# EAGLE design Digital Greippi (EAGLE 7.4.0)
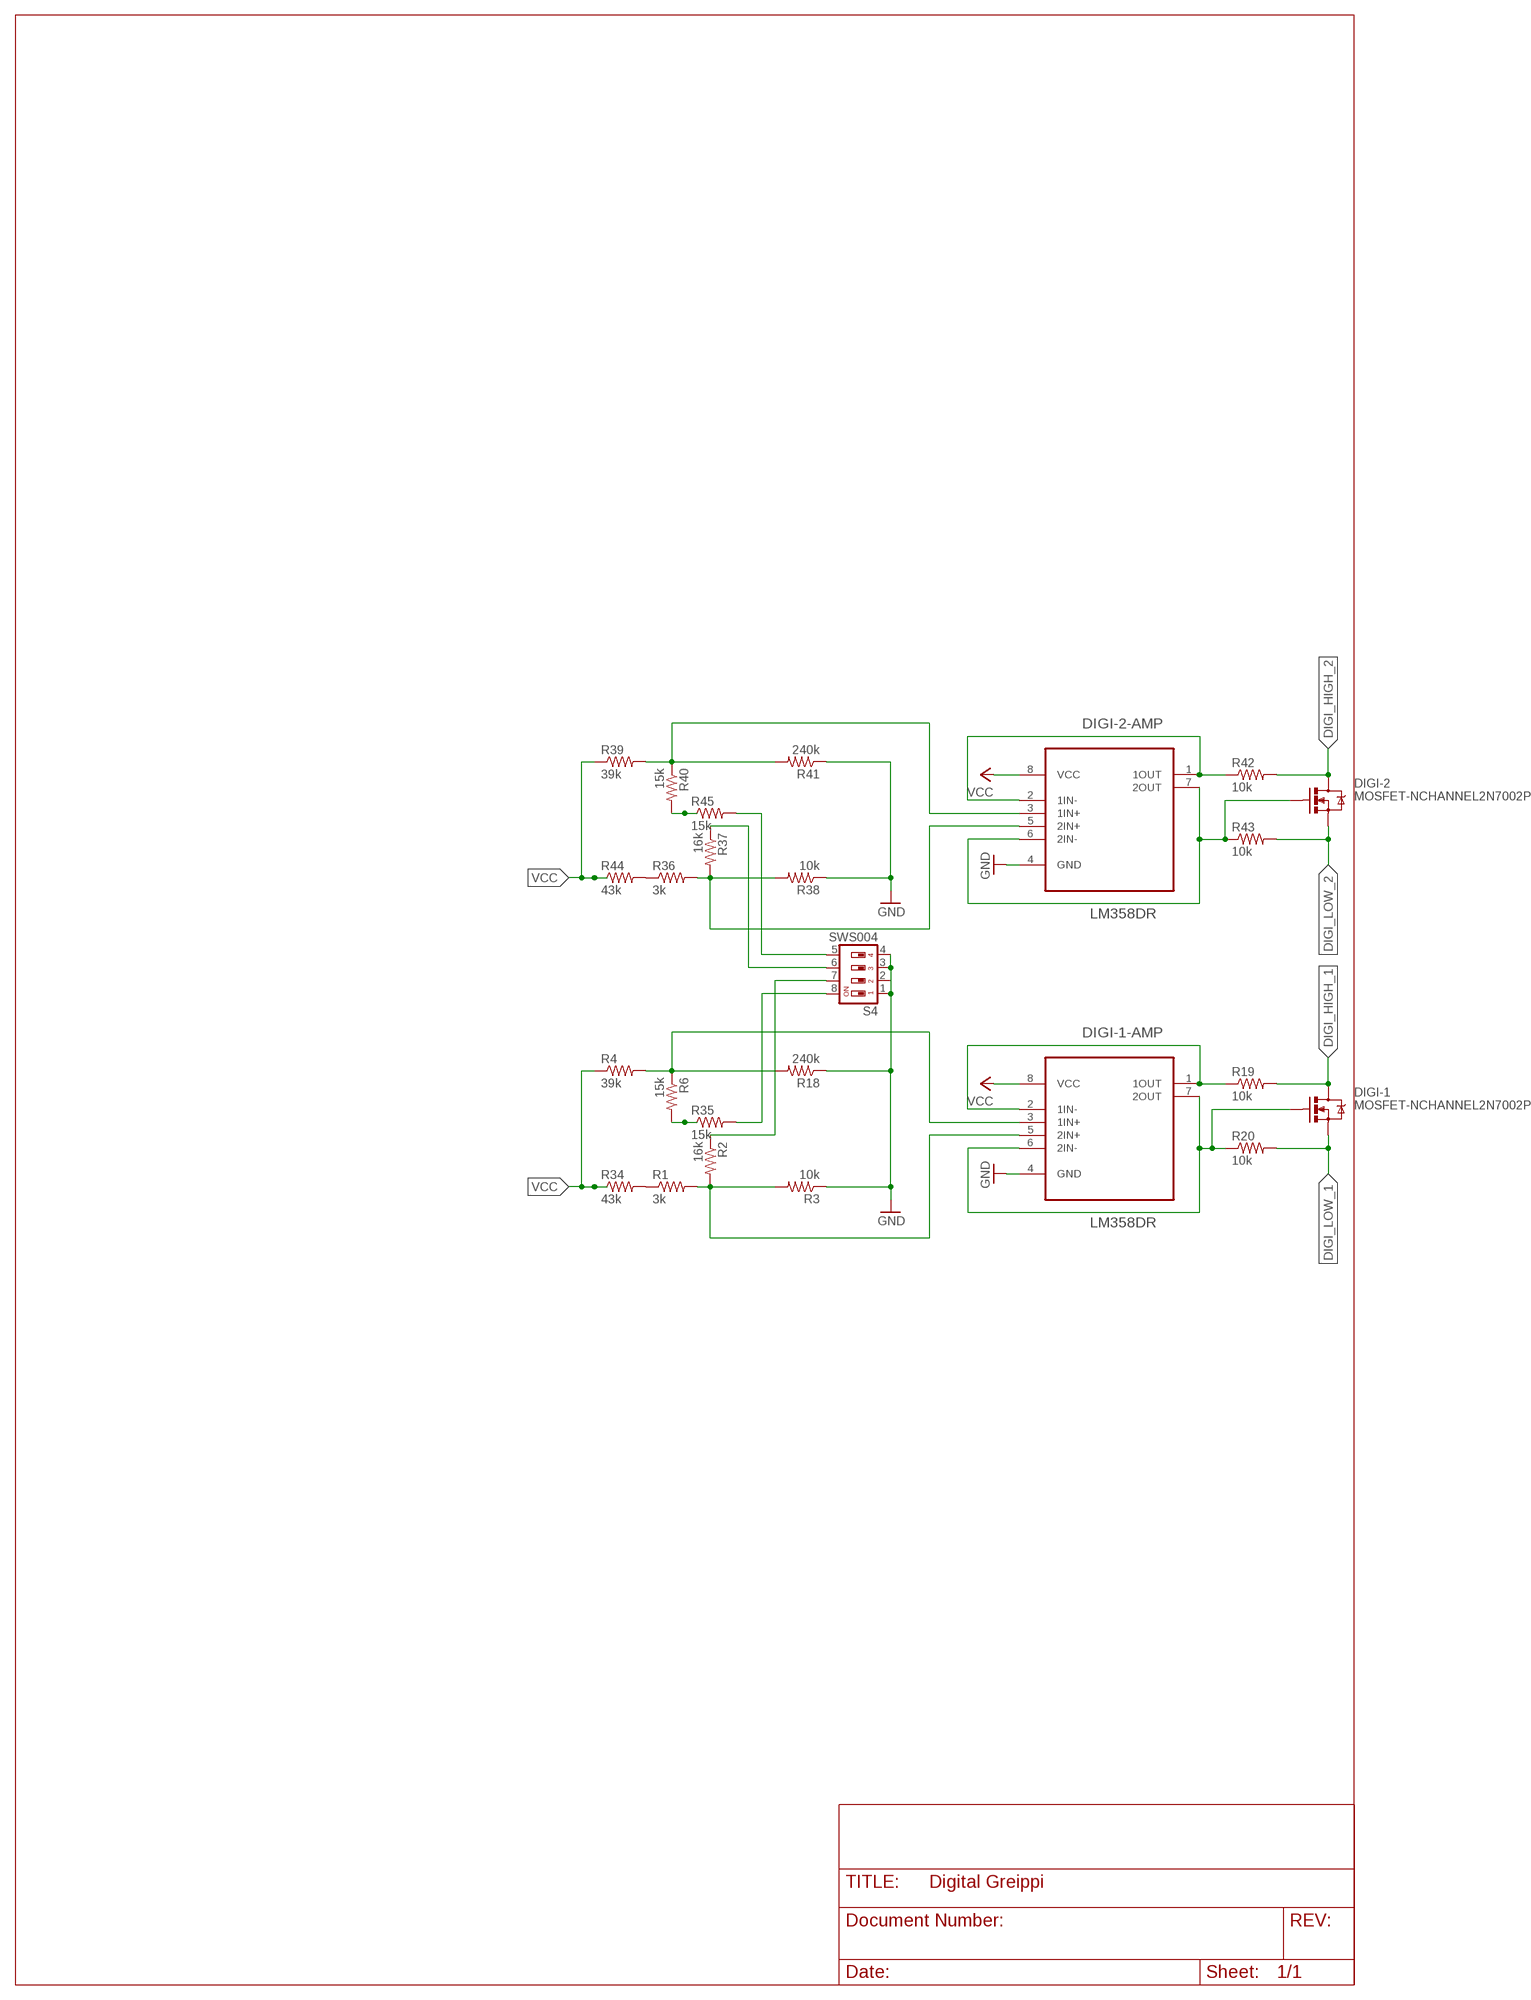
[diagram p0: schematic, sheet 1]

## Parts
DIGI-1  MOSFET-NCHANNEL2N7002PW  [SOT323]
DIGI-1-AMP  LM358DR  [SOIC127P600X175-8N]
DIGI-2  MOSFET-NCHANNEL2N7002PW  [SOT323]
DIGI-2-AMP  LM358DR  [SOIC127P600X175-8N]
R1  3k  R-US_R0805  [R0805]
R2  16k  R-US_R0805  [R0805]
R3  10k  R-US_R0805  [R0805]
R4  39k  R-US_R0805  [R0805]
R6  15k  R-US_R0805  [R0805]
R18  240k  R-US_R0805  [R0805]
R19  10k  R-US_R0805  [R0805]
R20  10k  R-US_R0805  [R0805]
R34  43k  R-US_R0805  [R0805]
R35  15k  R-US_R0805  [R0805]
R36  3k  R-US_R0805  [R0805]
R37  16k  R-US_R0805  [R0805]
R38  10k  R-US_R0805  [R0805]
R39  39k  R-US_R0805  [R0805]
R40  15k  R-US_R0805  [R0805]
R41  240k  R-US_R0805  [R0805]
R42  10k  R-US_R0805  [R0805]
R43  10k  R-US_R0805  [R0805]
R44  43k  R-US_R0805  [R0805]
R45  15k  R-US_R0805  [R0805]
S4  SWS004  [SMS-004]

## Nets
2IN+: DIGI-1-AMP.5(2IN+) R1.2 R2.2 R3.2
+2IN: DIGI-2-AMP.5(2IN+) R36.2 R37.2 R38.2
DI-1: DIGI-1-AMP.1(1OUT) DIGI-1-AMP.2(1IN-) R19.1
DIGI_HIGH_1: DIGI-1.3(D) R19.2
DIGI_HIGH_2: DIGI-2.3(D) R42.2
DIGI_LOW_1: DIGI-1.2(S) R20.2
DIGI_LOW_2: DIGI-2.2(S) R43.2
GND: DIGI-1-AMP.4(GND) DIGI-2-AMP.4(GND) R3.1 R18.1 R38.1 R41.1 S4.1 S4.2 S4.3 S4.4
N$2: DIGI-1-AMP.3(1IN+) R4.2 R6.1 R18.2
N$4: R2.1 S4.7
N$5: R6.2 R35.1
N$8: DIGI-1-AMP.6(2IN-) DIGI-1-AMP.7(2OUT) DIGI-1.1(G) R20.1
N$11: DIGI-2-AMP.3(1IN+) R39.2 R40.1 R41.2
N$15: R1.1 R34.2
N$42: R35.2 S4.8
N$63: DIGI-2-AMP.1(1OUT) DIGI-2-AMP.2(1IN-) R42.1
N$64: DIGI-2-AMP.6(2IN-) DIGI-2-AMP.7(2OUT) DIGI-2.1(G) R43.1
N$67: R37.1 S4.6
N$68: R36.1 R44.2
N$69: R40.2 R45.1
N$70: R45.2 S4.5
VCC: DIGI-1-AMP.8(VCC) DIGI-2-AMP.8(VCC) R4.1 R34.1 R39.1 R44.1

## Library data of the parts
DIGI-1 DIGI-2 = SparkFun-DiscreteSemi:MOSFET-NCHANNEL: Common NMOSFET Parts MFG P/N Store ID Prod ID FDD8780 TRANS-09984 SI7820DN TRANS-11055 FDS6630A IC-08089 2N7002PW TRANS-11151 FQP30N06L COM-10213 TRANS-10060 BSS123LT1G TRANS-08345 BSS138 TRANS-00830 BS170 2N7000; PROD_ID: TRANS-11151
DIGI-1-AMP DIGI-2-AMP = Texas Instruments_By_element14_Batch_1:LM358DR: OPERATIONAL AMPLIFIERS; MPN: LM358DR; OC_FARNELL: 1831865; OC_NEWARK: 34K7599; PACKAGE: SOIC-8; SUPPLIER: Texas Instruments
R1-R4 R6 R18-R20 R34-R45 = rcl:R-US_: RESISTOR, American symbol
S4 = smd-special:SWS004: SMD Dip Switch 4 pol.

## Board
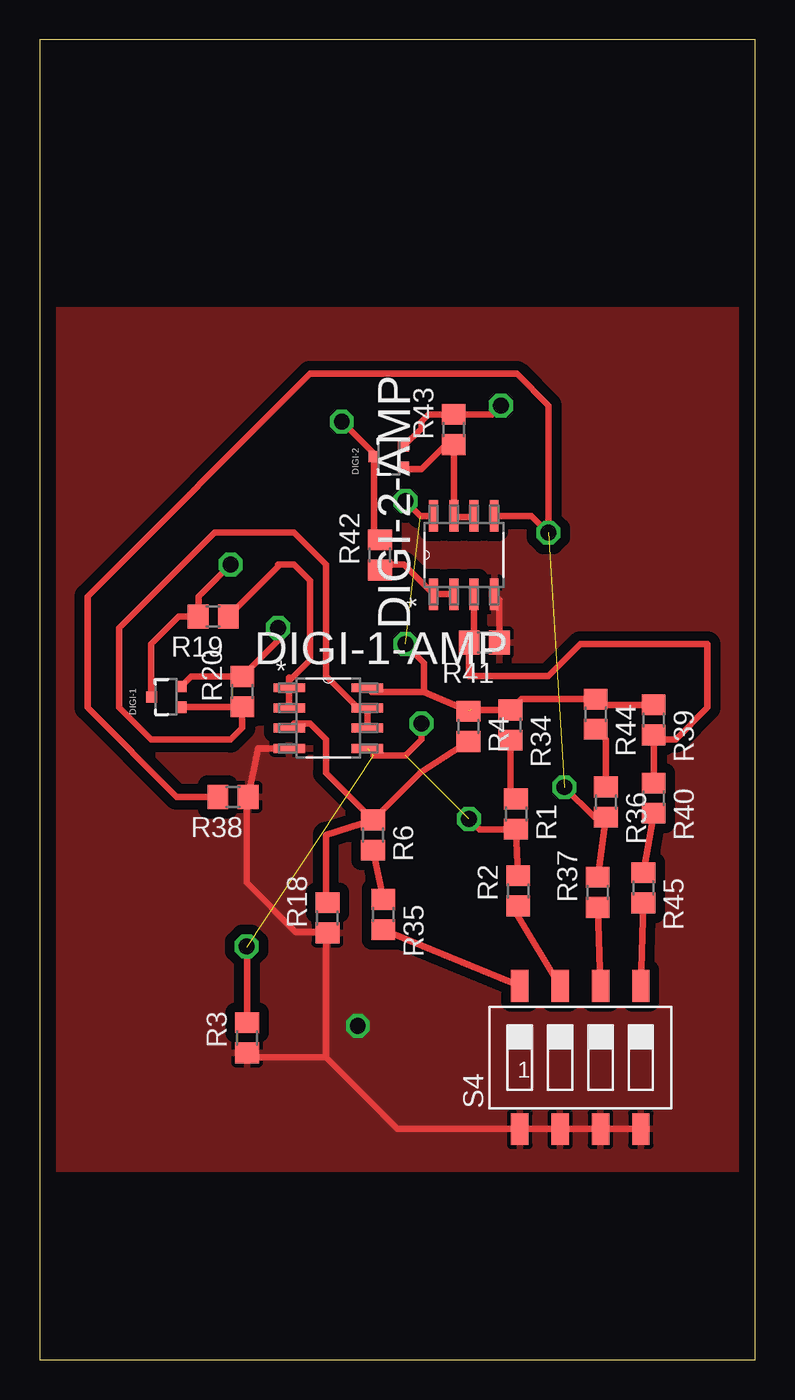
[diagram p1: board, top side]
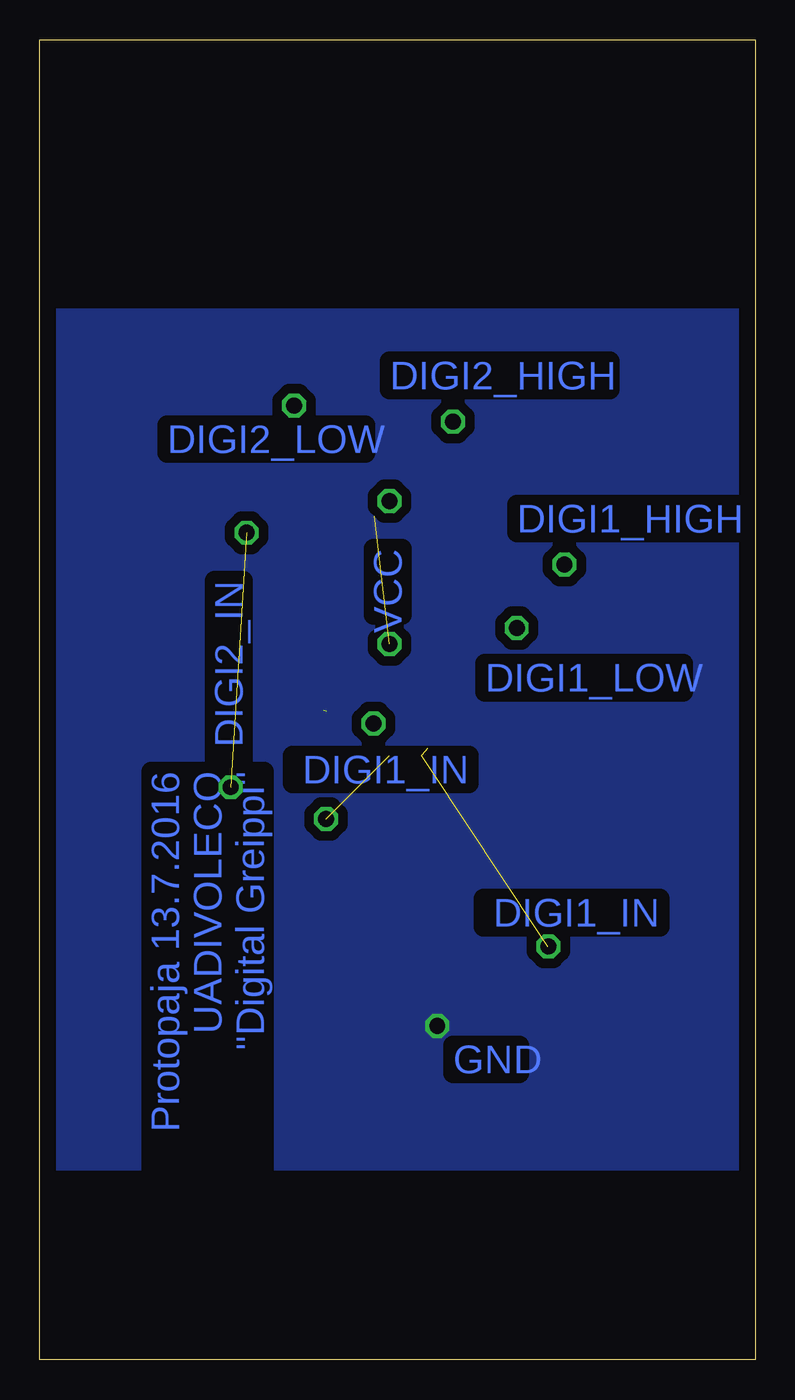
[diagram p2: board, bottom side, seen from below]

Size 45 x 83 mm. Coordinates in mm from the lower left corner, seen from the top.
Outline: 0,0 45,0 45,83 0,83 0,0
Copper layers (1*16): Top 0.035mm / dielectric 1.5mm / Bottom 0.035mm
Design rules "default": minimum track width 10mil, minimum drill 24mil, track to track 8mil, track to pad 8mil, pad to pad 8mil, via to via 8mil, smd to smd 8mil, copper to edge 40mil, drill to drill 8mil, minimum pad ring 10mil, minimum via ring 8mil, stop-mask expansion 4mil, vias tented up to drill 0mil, thermal gap 10mil

### Footprints (pad centres in the part's own frame; a part is rotated, then mirrored left to right if it is on the bottom)
SOT323 = smd 0.7 x 0.7: 1 -0.65,-0.925; 2 0.65,-0.925; 3 0,0.925
SOIC127P600X175-8N = smd 1.981 x 0.559: 1 -2.464,1.905; 2 -2.464,0.635; 3 -2.464,-0.635; 4 -2.464,-1.905; 5 2.464,-1.905; 6 2.464,-0.635; 7 2.464,0.635; 8 2.464,1.905
R0805 = smd 1.3 x 1.5: 1 -0.95,0; 2 0.95,0
SMS-004 = smd 1.092 x 2.007: 1 -3.81,-4.496; 2 -1.27,-4.496; 3 1.27,-4.496; 4 3.81,-4.496; 5 3.81,4.496; 6 1.27,4.496; 7 -1.27,4.496; 8 -3.81,4.496

### Placement (x,y rotation side)
DIGI-1  7.96,41.68 90 top
DIGI-1-AMP  18.15,40.35 0 top
DIGI-2  21.96,56.79 90 top
DIGI-2-AMP  26.68,50.6 90 top
R1  29.96,34.31 270 top
R2  30.09,29.49 90 top
R3  13.04,20.25 90 top
R4  26.96,39.83 270 top
R6  20.96,32.99 270 top
R18  18.09,27.79 90 top
R19  10.91,46.74 180 top
R20  12.74,42.01 90 top
R34  29.61,39.91 270 top
R35  21.61,27.99 270 top
R36  35.61,35.07 270 top
R37  35.09,29.39 90 top
R38  12.15,35.39 180 top
R39  38.61,40.23 270 top
R40  38.61,35.31 270 top
R41  27.96,45.09 180 top
R42  21.39,50.61 90 top
R43  26.04,58.49 90 top
R44  34.96,40.59 270 top
R45  37.96,29.67 270 top
S4  34,19 0 top

### Tracks (layer width: path | path; a pad name or v marks a point on that pad's centre or on a via)
2IN+  (via drill 1 pad 1.42)  (3 unrouted)
  Top 0.406: v24,40 24,39 23,38 21,38 | R2.2 R1.2 27.64,33.36 v27,34 | R3.2 13.04,25.96 13,26
+2IN  (via drill 1 pad 1.42)  (1 unrouted)
  Top 0.406: R37.2 R36.2 34.88,34.12 33,36 | DIGI-2-AMP.5 30.94,53.06 v32,52 32,60 30,62 17,62 3,48 3,41 8.61,35.39 R38.2
DI-1
  Top 0.406: DIGI-1-AMP.1 DIGI-1-AMP.2 | DIGI-1-AMP.1 15.69,42.91 | R19.1 15,49.88 15,50 16,50 17,49 17,44 15.69,42.69 DIGI-1-AMP.1
DIGI_HIGH_1  (via drill 1 pad 1.42)
  Top 0.406: DIGI-1.3 7,41.72 7,45 8.74,46.74 R19.2 10,46.78 10,48 v12,50
DIGI_HIGH_2  (via drill 1 pad 1.42)
  Top 0.406: R42.2 21.04,51.91 DIGI-2.3 21.04,56.97 v19,59
DIGI_LOW_1  (via drill 1 pad 1.42)
  Top 0.406: DIGI-1.2 9.52,42.96 R20.2 15,45.22 v15,46
DIGI_LOW_2  (via drill 1 pad 1.42)
  Top 0.406: DIGI-2.2 24,58.55 24,59 24.44,59.44 R43.2 28.44,59.44 v29,60
GND  (via drill 1 pad 1.42)
  Top 0.406: S4.4 S4.3 S4.2 S4.1 22.5,14.5 18,19 | 18,19 13.34,19 R3.1 | 18,19 18,26.75 R18.1 18.09,26.91 16.09,26.91 13,30 13,35.29 R38.1 13.73,38.45 DIGI-1-AMP.4 | R41.1 28.91,47.81 DIGI-2-AMP.4
  other vias: 20,21
  pour Bottom (isolate 0.61): 0,66 0,12 45,12 45,66
  pour Top (isolate 0.61): 0,12 45,12 45,66 0,66
N$2
  Top 0.406: R18.2 18,29 18,33 R6.1 | R4.2 23.96,36.94 R6.1 | DIGI-1-AMP.3 15.71,39.72 16,40 17,40 18,39 18,36.9 R6.1
N$4
  Top 0.406: S4.7 30,28 R2.1
N$5
  Top 0.406: R35.1 R6.2
N$8
  Top 0.406: DIGI-1-AMP.6 DIGI-1-AMP.7 20,41 18,43 18,44 18,45 18,50 16,52 11,52 5,46 5,41 7,39 12,39 12.74,39.74 R20.1 12.71,41.03 DIGI-1.1
N$9  (via drill 1 pad 1.42)
  other vias: 13,26
N$11
  Top 0.406: DIGI-2-AMP.3 27.32,45.4 R41.2 27.01,43.01 27,43 32,43 34,45 42,45 42,41 40,39 38.89,39 R39.2 R40.1 39,36.65
N$15
  Top 0.406: R34.2 29.61,35.61 R1.1
N$16  (via drill 1 pad 1.42)
  other vias: 33,36
N$42
  Top 0.406: S4.8 R35.2
N$63
  Top 0.406: DIGI-2-AMP.2 DIGI-2-AMP.1 22.91,50 21,50 21.34,49.66 R42.1
N$64
  Top 0.406: DIGI-2-AMP.6 27.06,53.06 27,53 26.11,53 DIGI-2-AMP.7 R43.1 25.54,57.54 24,56 23.02,56 DIGI-2.1
N$67
  Top 0.406: S4.6 R37.1
N$68
  Top 0.406: R36.1 35.61,38.99 R44.2
N$69
  Top 0.406: R45.1 R40.2
N$70
  Top 0.406: S4.5 R45.2
VCC  (via drill 1 pad 1.42)  (2 unrouted)
  Top 0.406: R39.1 35.32,41.18 R44.1 30.29,41.54 R34.1 27.14,40.86 | 24.18,42 R4.1 | DIGI-2-AMP.8 23.94,53.06 v23,54 | 24.18,42 24.18,43.82 v23,45 | 24.18,42 20.87,42 DIGI-1-AMP.8

### Text on the board
Bottom: DIGI2_HIGH | DIGI2_LOW | DIGI1_HIGH | VCC | DIGI2_IN | DIGI1_LOW | DIGI1_IN | Protopaja 13.7.2016 / UADIVOLECO / "Digital Greippi" | DIGI1_IN | GND